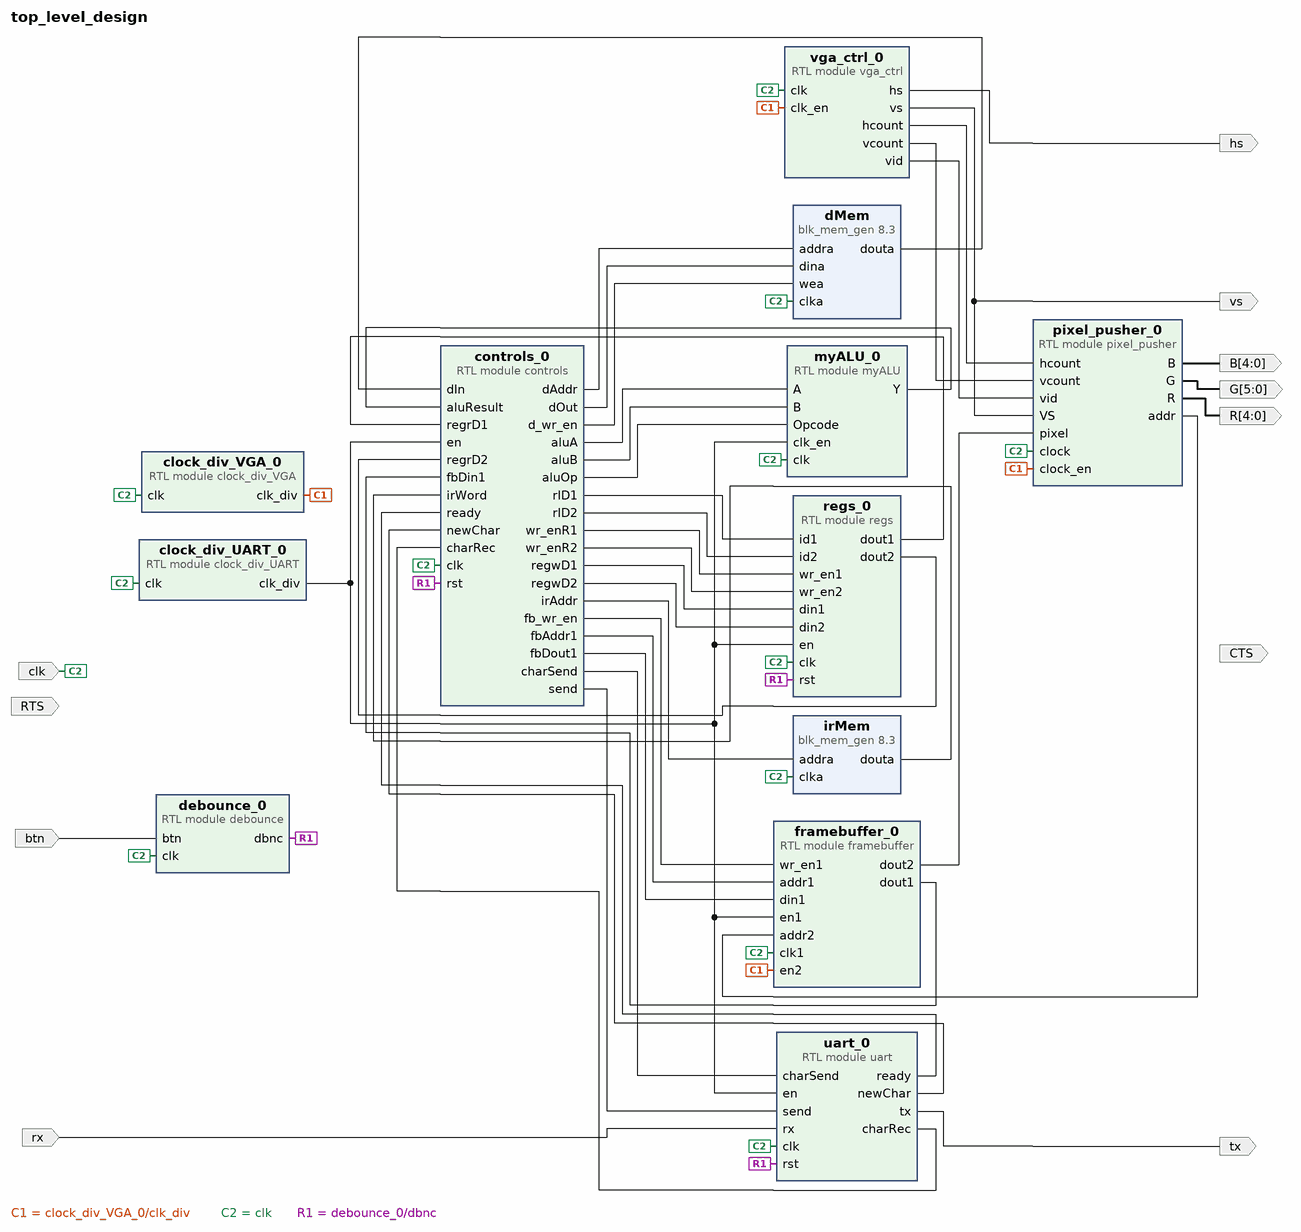
[diagram p0: block diagram of the top level]
# Vivado block design top_level_design, xc7z010clg400-1, Vivado 2016.4
create_bd_design top_level_design

create_bd_port -dir O CTS
create_bd_port -dir I RTS
create_bd_port -dir I -type clk clk
create_bd_port -dir I btn
create_bd_port -dir O vs
create_bd_port -dir O hs
create_bd_port -dir O -from 4 -to 0 R
create_bd_port -dir O -from 4 -to 0 B
create_bd_port -dir O -from 5 -to 0 G
create_bd_port -dir O tx
create_bd_port -dir I rx

create_bd_cell -type ip -vlnv xilinx.com:ip:blk_mem_gen:8.3 irMem
set_property -dict [list \
  CONFIG.Memory_Type Single_Port_ROM \
  CONFIG.Enable_32bit_Address false \
  CONFIG.Enable_A Always_Enabled \
  CONFIG.Register_PortA_Output_of_Memory_Primitives false \
  CONFIG.Load_Init_File true \
  CONFIG.Coe_File {../../../../../../../../../Dropbox/Year 4/Fall/Embedded_Devices/Lab_5/hello2.coe} \
  CONFIG.Use_RSTA_Pin false \
  CONFIG.Port_A_Write_Rate 0 \
  CONFIG.use_bram_block Stand_Alone \
] [get_bd_cells irMem]
create_bd_cell -type ip -vlnv xilinx.com:ip:blk_mem_gen:8.3 dMem
set_property -dict [list \
  CONFIG.Enable_32bit_Address false \
  CONFIG.Use_Byte_Write_Enable false \
  CONFIG.Write_Width_A 16 \
  CONFIG.Read_Width_A 16 \
  CONFIG.Enable_A Always_Enabled \
  CONFIG.Register_PortA_Output_of_Memory_Primitives false \
  CONFIG.Load_Init_File true \
  CONFIG.Coe_File {../../../../../../../../../Dropbox/Year 4/Fall/Embedded_Devices/Lab_5/hello_data2.coe} \
  CONFIG.Use_RSTA_Pin false \
  CONFIG.use_bram_block Stand_Alone \
] [get_bd_cells dMem]
create_bd_cell -type module -reference myALU myALU_0
create_bd_cell -type module -reference uart uart_0
create_bd_cell -type module -reference framebuffer framebuffer_0
create_bd_cell -type module -reference clock_div_UART clock_div_UART_0
create_bd_cell -type module -reference debounce debounce_0
create_bd_cell -type module -reference clock_div_VGA clock_div_VGA_0
create_bd_cell -type module -reference pixel_pusher pixel_pusher_0
create_bd_cell -type module -reference vga_ctrl vga_ctrl_0
create_bd_cell -type module -reference regs regs_0
create_bd_cell -type module -reference controls controls_0

# ---- connections ----

connect_bd_net [get_bd_pins regs_0/dout1] [get_bd_pins controls_0/regrD1]
connect_bd_net [get_bd_pins regs_0/dout2] [get_bd_pins controls_0/regrD2]
connect_bd_net [get_bd_pins controls_0/rID1] [get_bd_pins regs_0/id1]
connect_bd_net [get_bd_pins controls_0/rID2] [get_bd_pins regs_0/id2]
connect_bd_net [get_bd_pins controls_0/wr_enR1] [get_bd_pins regs_0/wr_en1]
connect_bd_net [get_bd_pins controls_0/wr_enR2] [get_bd_pins regs_0/wr_en2]
connect_bd_net [get_bd_pins controls_0/regwD1] [get_bd_pins regs_0/din1]
connect_bd_net [get_bd_pins controls_0/regwD2] [get_bd_pins regs_0/din2]
connect_bd_net [get_bd_pins controls_0/fb_wr_en] [get_bd_pins framebuffer_0/wr_en1]
connect_bd_net [get_bd_pins controls_0/fbAddr1] [get_bd_pins framebuffer_0/addr1]
connect_bd_net [get_bd_pins controls_0/fbDout1] [get_bd_pins framebuffer_0/din1]
connect_bd_net [get_bd_pins framebuffer_0/dout1] [get_bd_pins controls_0/fbDin1]
connect_bd_net [get_bd_pins irMem/douta] [get_bd_pins controls_0/irWord]
connect_bd_net [get_bd_pins controls_0/irAddr] [get_bd_pins irMem/addra]
connect_bd_net [get_bd_pins controls_0/dAddr] [get_bd_pins dMem/addra]
connect_bd_net [get_bd_pins controls_0/dOut] [get_bd_pins dMem/dina]
connect_bd_net [get_bd_pins controls_0/d_wr_en] [get_bd_pins dMem/wea]
connect_bd_net [get_bd_pins dMem/douta] [get_bd_pins controls_0/dIn]
connect_bd_net [get_bd_pins controls_0/aluA] [get_bd_pins myALU_0/A]
connect_bd_net [get_bd_pins controls_0/aluB] [get_bd_pins myALU_0/B]
connect_bd_net [get_bd_pins controls_0/aluOp] [get_bd_pins myALU_0/Opcode]
connect_bd_net [get_bd_pins myALU_0/Y] [get_bd_pins controls_0/aluResult]
connect_bd_net [get_bd_pins uart_0/ready] [get_bd_pins controls_0/ready]
connect_bd_net [get_bd_pins uart_0/newChar] [get_bd_pins controls_0/newChar]
connect_bd_net [get_bd_pins uart_0/charRec] [get_bd_pins controls_0/charRec]
connect_bd_net [get_bd_pins controls_0/charSend] [get_bd_pins uart_0/charSend]
connect_bd_net [get_bd_pins controls_0/send] [get_bd_pins uart_0/send]
connect_bd_net [get_bd_pins clock_div_VGA_0/clk_div] \
  [get_bd_pins vga_ctrl_0/clk_en] [get_bd_pins pixel_pusher_0/clock_en] [get_bd_pins framebuffer_0/en2]
connect_bd_net [get_bd_pins clock_div_UART_0/clk_div] \
  [get_bd_pins framebuffer_0/en1] [get_bd_pins uart_0/en] [get_bd_pins myALU_0/clk_en] [get_bd_pins regs_0/en] \
  [get_bd_pins controls_0/en]
connect_bd_net [get_bd_ports clk] \
  [get_bd_pins clock_div_UART_0/clk] [get_bd_pins debounce_0/clk] [get_bd_pins clock_div_VGA_0/clk] [get_bd_pins irMem/clka] \
  [get_bd_pins dMem/clka] [get_bd_pins vga_ctrl_0/clk] [get_bd_pins pixel_pusher_0/clock] [get_bd_pins framebuffer_0/clk1] \
  [get_bd_pins myALU_0/clk] [get_bd_pins uart_0/clk] [get_bd_pins regs_0/clk] [get_bd_pins controls_0/clk]
connect_bd_net [get_bd_ports btn] [get_bd_pins debounce_0/btn]
connect_bd_net [get_bd_pins vga_ctrl_0/hcount] [get_bd_pins pixel_pusher_0/hcount]
connect_bd_net [get_bd_pins vga_ctrl_0/vcount] [get_bd_pins pixel_pusher_0/vcount]
connect_bd_net [get_bd_pins vga_ctrl_0/vid] [get_bd_pins pixel_pusher_0/vid]
connect_bd_net [get_bd_pins vga_ctrl_0/vs] [get_bd_ports vs] [get_bd_pins pixel_pusher_0/VS]
connect_bd_net [get_bd_pins vga_ctrl_0/hs] [get_bd_ports hs]
connect_bd_net [get_bd_pins pixel_pusher_0/R] [get_bd_ports R]
connect_bd_net [get_bd_pins pixel_pusher_0/B] [get_bd_ports B]
connect_bd_net [get_bd_pins pixel_pusher_0/G] [get_bd_ports G]
connect_bd_net [get_bd_pins pixel_pusher_0/addr] [get_bd_pins framebuffer_0/addr2]
connect_bd_net [get_bd_pins framebuffer_0/dout2] [get_bd_pins pixel_pusher_0/pixel]
connect_bd_net [get_bd_pins uart_0/tx] [get_bd_ports tx]
connect_bd_net [get_bd_ports rx] [get_bd_pins uart_0/rx]
connect_bd_net [get_bd_pins debounce_0/dbnc] [get_bd_pins uart_0/rst] [get_bd_pins regs_0/rst] [get_bd_pins controls_0/rst]

validate_bd_design
save_bd_design
